# Altium schematic sheet modFOC_IO.SchDoc
size A4; Organization: Altium Limited; Address1: L3, 12a Rodborough Rd; Address2: Frenchs Forest; Address3: NSW; Address4: Australia 2086
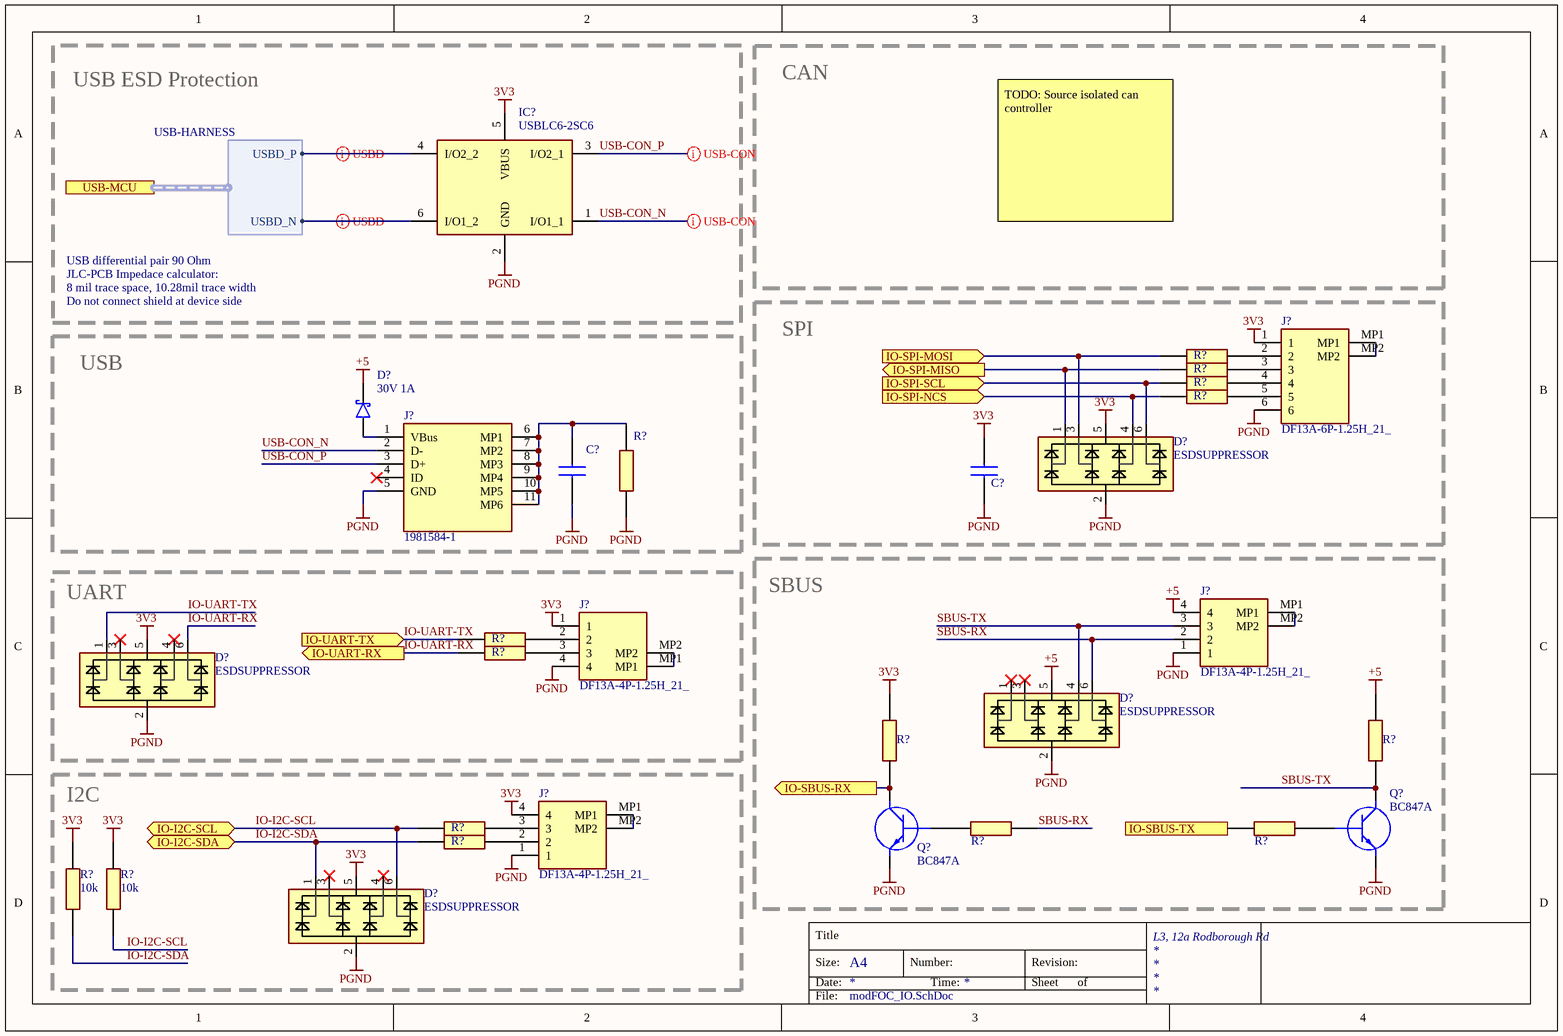
[diagram p0: modFOC_IO.SchDoc]

## Parts
(Parts that share a designator on the sheet are numbered #1, #2 ... from top to bottom, then left to right.)
C?#1  1nF  [CAPC1608X97N]  (value not drawn)
C?#2  100nF  [CAPC1608X97N]  (value not drawn)
D?#1  30V 1A  [SOD-323]
D?#2  ESDSUPPRESSOR  [SOT23-6]
D?#3  ESDSUPPRESSOR  [SOT23-6]
D?#4  ESDSUPPRESSOR  [SOT23-6]
D?#5  ESDSUPPRESSOR  [SOT23-6]
IC?  USBLC6-2SC6  [SOT95P280X145-6N]
J?#1  DF13A-6P-1.25H_21_  [DF13A6P125H21]
J?#2  1981584-1  [19815841]
J?#3  DF13A-4P-1.25H_21_  [DF13A4P125H21]
J?#4  DF13A-4P-1.25H_21_  [DF13A4P125H21]
J?#5  DF13A-4P-1.25H_21_  [DF13A4P125H21]
Q?#1  BC847A  [SOT95P230X110-3N]
Q?#2  BC847A  [SOT95P230X110-3N]
R?#1  100R  [RESC1005X40N]  (value not drawn)
R?#2  100R  [RESC1005X40N]  (value not drawn)
R?#3  100R  [RESC1005X40N]  (value not drawn)
R?#4  100R  [RESC1005X40N]  (value not drawn)
R?#5  1M  [RESC1608X50N]  (value not drawn)
R?#6  100R  [RESC1005X40N]  (value not drawn)
R?#7  100R  [RESC1005X40N]  (value not drawn)
R?#8  10k  [RESC1608X50N]  (value not drawn)
R?#9  10k  [RESC1608X50N]  (value not drawn)
R?#10  100R  [RESC1005X40N]  (value not drawn)
R?#11  1k  [RESC1608X50N]  (value not drawn)
R?#12  1k  [RESC1608X50N]  (value not drawn)
R?#13  10k  [RESC1608X50N]
R?#14  10k  [RESC1608X50N]
R?#15  100R  [RESC1005X40N]  (value not drawn)

## Blocks framed on the sheet
SPI: C?#2 D?#2 J?#1 R?#1-R?#4
USB: C?#1 D?#1 J?#2 R?#5
SBUS: D?#4 J?#3 Q?#1 Q?#2 R?#8 R?#9 R?#11 R?#12
I2C: D?#5 J?#5 R?#10 R?#13-R?#15

## Ports
IO-I2C-SCL (bidir), IO-I2C-SDA (bidir), IO-SBUS-RX (out), IO-SBUS-TX (in), IO-SPI-MISO (out), IO-SPI-MOSI (in), IO-SPI-NCS (in), IO-SPI-SCL (in), IO-UART-RX (out), IO-UART-TX (in), USB-MCU (harness USB-HARNESS)

## Harnesses
USB-HARNESS: USBD_P, USBD_N

## Nets
3V3: C?#2.2 D?#2.5(VDD) D?#3.5(VDD) D?#5.5(VDD) IC?.5(VBUS) J?#1.1 J?#4.1 J?#5.4 R?#8.2 R?#13.1 R?#14.1
+5: D?#1.1(K) D?#4.5(VDD) J?#3.4 R?#9.2
PGND: C?#1.1 C?#2.1 D?#2.2(GND) D?#3.2(GND) D?#4.2(GND) D?#5.2(GND) IC?.2(GND) J?#1.6 J?#2.5(GND) J?#3.1 J?#4.4 J?#5.1 Q?#1.2(E) Q?#2.2(E) R?#5.1
IO-I2C-SCL: D?#5.6(CH4) R?#10.1 R?#14.2 ; port IO-I2C-SCL
IO-I2C-SDA: D?#5.1(CH1) R?#13.2 R?#15.1 ; port IO-I2C-SDA
IO-SBUS-RX: Q?#1.3(C) R?#8.1 ; port IO-SBUS-RX
IO-SBUS-TX: R?#12.2 ; port IO-SBUS-TX
IO-SPI-MISO: D?#2.1(CH1) R?#2.1 ; port IO-SPI-MISO
IO-SPI-MOSI: D?#2.3(CH2) R?#1.1 ; port IO-SPI-MOSI
IO-SPI-NCS: D?#2.4(CH3) R?#4.1 ; port IO-SPI-NCS
IO-SPI-SCL: D?#2.6(CH4) R?#3.1 ; port IO-SPI-SCL
IO-UART-RX: D?#3.6(CH4) R?#7.1 ; port IO-UART-RX
IO-UART-TX: D?#3.1(CH1) R?#6.1 ; port IO-UART-TX
SBUS-RX: D?#4.6(CH4) J?#3.2 R?#11.2
SBUS-TX: D?#4.4(CH3) J?#3.3 Q?#2.3(C) R?#9.1
USB-CON_N: IC?.1(I/O1_1) J?#2.2(D-)
USB-CON_P: IC?.3(I/O2_1) J?#2.3(D+)
NetC?#1_2: C?#1.2 J?#2.6(MP1) J?#2.7(MP2) J?#2.8(MP3) J?#2.9(MP4) J?#2.10(MP5) J?#2.11(MP6) R?#5.2
NetD?#1_2: D?#1.2(A) J?#2.1(VBus)
NetIC?_4: IC?.4(I/O2_2) ; port USB-MCU.USBD_P
NetIC?_6: IC?.6(I/O1_2) ; port USB-MCU.USBD_N
NetJ?#1_2: J?#1.2 R?#1.2
NetJ?#1_3: J?#1.3 R?#2.2
NetJ?#1_4: J?#1.4 R?#3.2
NetJ?#1_5: J?#1.5 R?#4.2
NetJ?#1_MP1: J?#1.MP1 J?#1.MP2
NetJ?#3_MP1: J?#3.MP1 J?#3.MP2
NetJ?#4_2: J?#4.2 R?#6.2
NetJ?#4_3: J?#4.3 R?#7.2
NetJ?#4_MP1: J?#4.MP1 J?#4.MP2
NetJ?#5_2: J?#5.2 R?#15.2
NetJ?#5_3: J?#5.3 R?#10.2
NetJ?#5_MP1: J?#5.MP1 J?#5.MP2
NetQ?#1_1: Q?#1.1(B) R?#11.1
NetQ?#2_1: Q?#2.1(B) R?#12.1

Not connected (* = marked no-connect by the designer): D?#3 3(CH2)* 4(CH3)*; D?#4 1(CH1)* 3(CH2)*; D?#5 3(CH2)* 4(CH3)*; J?#2 4(ID)*

## Layout directives
differential pair: NetIC?_4, NetIC?_6, USB-CON_N, USB-CON_P

## Notes on the sheet
- USB ESD Protection
- CAN
- TODO: Source isolated can controller
- USB differential pair 90 Ohm
- JLC-PCB Impedace calculator:
- Do not connect shield at device side
- 8 mil trace space, 10.28mil trace width
- (near D?#3) UART
- Title
- Size:
- Date:
- A4
- Number:
- Time:
- Revision:
- Sheet
- of
- File:

## Library data of the parts
C?#1 C?#2 = C0603: Capacitor; Height: 0.97
D?#1 = SCHOTTKY-DIODE: Schottky Diode
D?#2-D?#5 = ESDSUPPRESSOR: TVS Diode Array; Height: 0.6mm
IC? = USBLC6-2SC6: Integrated Circuit; Manufacturer_Name: STMicroelectronics; Datasheet Link: http://www.st.com/st-web-ui/static/active/en/resource/technical/document/datasheet/CD00050750.pdf; Height: 1.45mm; Manufacturer_Part_Number: USBLC6-2SC6; Arrow Part Number: USBLC6-2SC6; Arrow Price/Stock: https://www.arrow.com/en/products/usblc6-2sc6/stmicroelectronics; Mouser Part Number: 511-USBLC6-2SC6; Mouser Price/Stock: https://www.mouser.co.uk/ProductDetail/STMicroelectronics/USBLC6-2SC6?qs=po45yt2pPpu%2FhNIlwQdTlg%3D%3D
J?#1 = DF13A-6P-1.25H_21_: Connector; Manufacturer_Name: Hirose; Manufacturer_Part_Number: DF13A-6P-1.25H(21); Datasheet Link: https://www.hirose.com/product/download/?distributor=digikey&type=2d&lang=en&num=DF13A-6P-1.25H(21); Height: 3.75mm; Mouser Part Number: 798-DF13A6P125H21; Mouser Price/Stock: https://www.mouser.co.uk/ProductDetail/Hirose-Connector/DF13A-6P-125H21?qs=XQjbzJWzFPXnreVi%252BPl0Lg%3D%3D; Arrow Part Number: DF13A-6P-1.25H(21); Arrow Price/Stock: https://www.arrow.com/en/products/df13a-6p-1.25h-21/hirose-electric
J?#2 = 1981584-1: Connector; Manufacturer_Name: TE Connectivity; Datasheet Link: http://www.te.com/commerce/DocumentDelivery/DDEController?Action=showdoc&DocId=Customer+Drawing%7F1981584%7FD2%7Fpdf%7FEnglish%7FENG_CD_1981584_D2.pdf%7F1981584-1; Height: 3mm; Manufacturer_Part_Number: 1981584-1; Arrow Part Number: 1981584-1; Arrow Price/Stock: https://www.arrow.com/en/products/1981584-1/te-connectivity; Mouser Part Number: 571-1981584-1; Mouser Price/Stock: https://www.mouser.co.uk/ProductDetail/TE-Connectivity/1981584-1?qs=ozkTL%2FUej0TLYxjQLPnd2Q%3D%3D
J?#3-J?#5 = DF13A-4P-1.25H_21_: Connector; Manufacturer_Name: Hirose; Manufacturer_Part_Number: DF13A-4P-1.25H(21); Datasheet Link: https://componentsearchengine.com/Datasheets/1/DF13A-4P-1.25H(21).pdf; Height: 3.6mm; Mouser Part Number: 798-DF13A4P125H21; Mouser Price/Stock: https://www.mouser.co.uk/ProductDetail/Hirose-Connector/DF13A-4P-125H21?qs=XQjbzJWzFPXWzMShI70F0w%3D%3D
Q?#1 Q?#2 = BC847A,235: Transistor BJT NPN; Manufacturer_Name: Nexperia; Datasheet Link: http://assets.nexperia.com/documents/data-sheet/BC847_SER.pdf; Height: 1.1mm; Manufacturer_Part_Number: BC847A,235; Mouser Part Number: 771-BC847A235; Mouser Price/Stock: https://www.mouser.co.uk/ProductDetail/Nexperia/BC847A235?qs=me8TqzrmIYWeD%252BqPzufrRA%3D%3D; Arrow Part Number: BC847A,235; Arrow Price/Stock: https://www.arrow.com/en/products/bc847a235/nexperia
R?#1-R?#4 R?#6 R?#7 R?#10 R?#15 = R0402: Resistor; Height: 0.4mm
R?#5 R?#8 R?#9 R?#11-R?#14 = R0603: Resistor; Manufacturer_Name: Panasonic; Manufacturer_Part_Number: ERJ-PA3J104V; Datasheet Link: https://industrial.panasonic.com/cdbs/www-data/pdf/RDO0000/AOA0000C331.pdf; Height: 0.55mm; Mouser Part Number: 667-ERJ-PA3J104V; Mouser Price/Stock: https://www.mouser.co.uk/ProductDetail/Panasonic/ERJ-PA3J104V/?qs=BzJM0faLVqV4tD3ZRAThew%3D%3D; Arrow Part Number: ERJ-PA3J104V; Arrow Price/Stock: https://www.arrow.com/en/products/erj-pa3j104v/panasonic